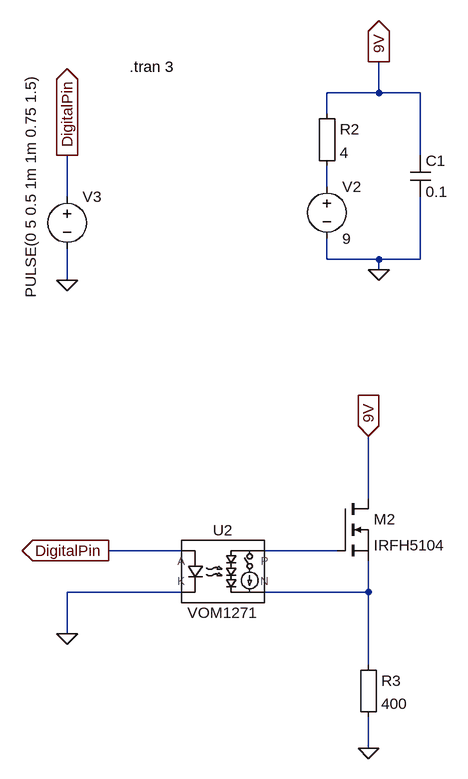
[diagram p0: schematic High_Side_Test.asc]
High_Side_Test.asc, the LTspice schematic file:
Version 4.1
SHEET 1 3176 1796
WIRE 2416 -608 2416 -656
WIRE 2416 -608 2336 -608
WIRE 2480 -608 2416 -608
WIRE 2336 -576 2336 -608
WIRE 2480 -512 2480 -608
WIRE 2336 -464 2336 -496
WIRE 1936 -448 1936 -512
WIRE 2336 -352 2336 -384
WIRE 2416 -352 2336 -352
WIRE 2480 -352 2480 -448
WIRE 2480 -352 2416 -352
WIRE 2416 -336 2416 -352
WIRE 1936 -320 1936 -368
WIRE 2400 16 2400 -80
WIRE 2112 96 2000 96
WIRE 2352 96 2240 96
WIRE 2112 160 1936 160
WIRE 2400 160 2400 112
WIRE 2400 160 2240 160
WIRE 1936 224 1936 160
WIRE 2400 272 2400 160
WIRE 2400 400 2400 352
FLAG 2416 -336 0
FLAG 2416 -656 9V
IOPIN 2416 -656 Out
FLAG 1936 -320 0
FLAG 1936 -512 DigitalPin
IOPIN 1936 -512 Out
FLAG 2400 -80 9V
IOPIN 2400 -80 In
FLAG 1936 224 0
FLAG 2000 96 DigitalPin
IOPIN 2000 96 Out
FLAG 2400 400 0
SYMBOL voltage 2336 -480 R0
WINDOW 123 0 0 Left 0
WINDOW 39 0 0 Left 0
SYMATTR InstName V2
SYMATTR Value 9
SYMBOL Misc\\EuropeanResistor 2320 -592 R0
SYMATTR InstName R2
SYMATTR Value 4
SYMBOL Misc\\EuropeanCap 2464 -512 R0
SYMATTR InstName C1
SYMATTR Value 0.1
SYMBOL voltage 1936 -464 R0
WINDOW 123 0 0 Left 0
WINDOW 39 0 0 Left 0
WINDOW 3 -56 -173 VRight 2
SYMATTR Value PULSE(0 5 0.5 1m 1m 0.75 1.5)
SYMATTR InstName V3
SYMBOL nmos 2352 16 R0
SYMATTR InstName M2
SYMATTR Value IRFH5104
SYMBOL Misc\\EuropeanResistor 2384 256 R0
SYMATTR InstName R3
SYMATTR Value 400
SYMBOL VOM1271 2176 128 R0
SYMATTR InstName U2
TEXT 2032 -648 Left 2 !.tran 3

The netlist it stands for:
* High_Side_Test.asc
V2 N001 0 9
R2 9V N001 4
C1 9V 0 0.1
V3 DigitalPin 0 PULSE(0 5 0.5 1m 1m 0.75 1.5)
M2 9V N002 N003 N003 IRFH5104
R3 N003 0 400
X§U2 DigitalPin 0 N002 N003 VOM1271 VOM1271  ; pins A K P N
.model NMOS NMOS
.model PMOS PMOS
.lib standard.mos
.tran 3
.lib VOM1271.cir
.backanno
.end